# Altium schematic sheet 11-IMU.SchDoc
size A4
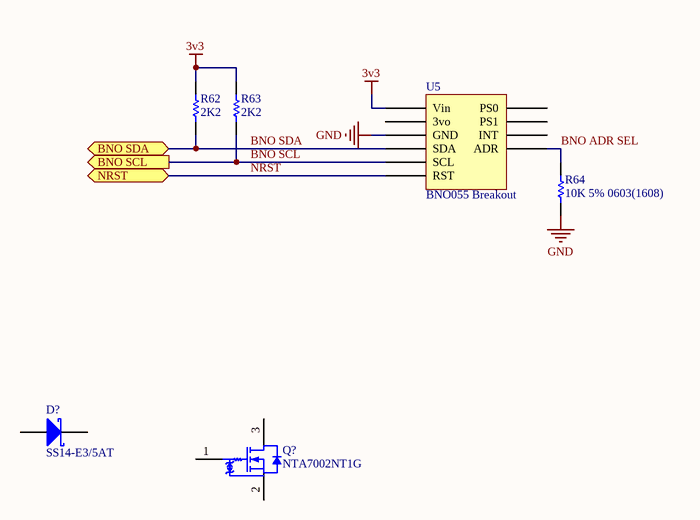
[diagram p0: 11-IMU.SchDoc]

## Parts
D?  SS14-E3/5AT  [VISH-DO-214AC-2_V]
Q?  NTA7002NT1G  [ONSC-SC-75-3-463-01_V]
R62  2K2  [RESC0603(1608)_N]
R63  2K2  [RESC0603(1608)_N]
R64  10K 5% 0603(1608)  [RESC0603(1608)_N]
U5  BNO055 Breakout  [BNO055]

## Ports
BNO SCL (out), BNO SDA (bidir), NRST (bidir)

## Nets
3v3: R62.2 R63.2 U5.1(Vin)
GND: R64.1 U5.3(GND)
BNO ADR SEL: R64.2 U5.10(ADR)
BNO SCL: R63.1 U5.5(SCL) ; port BNO SCL
BNO SDA: R62.1 U5.4(SDA) ; port BNO SDA
NRST: U5.6(RST) ; port NRST

Not connected (* = marked no-connect by the designer): D? 1(A) 2(K); Q? 1(G) 2(S) 3(D); U5 2(3vo) 7(PS0) 8(PS1) 9(INT)

## Library data of the parts
D? = CMP-0549-00004-1: Schottky Barrier Rectifier, 40 V Maximum DC Blocking Voltage, -65 to 125 degC, 2-Pin SMA Case, RoHS; Manufacturer: Vishay Semiconductor; IFSM: 40 A; IF(AV): 1 A Max.; VRRM: 40 V Max.; VRMS: 28 V Max.; PackageReference: DO-214AC-2; RoHS: TRUE; DatasheetVersion: 12/17/2012; ComponentLink1Description: Manufacturer URL; ComponentLink2URL: http://www.vishay.com/docs/88746/ss12.pdf; PartNumber: SS14-E3/5AT; PackageVersion: Dec-12; Operating Temperature: -65 to 125 degC; ComponentLink3URL: http://www.vishay.com/docs/88746/ss12.pdf; PackageDescription: 2-Pin SMD, Body 4.245 x 2.665 mm, Height 2.29 mm; ComponentLink1URL: http://www.vishay.com/; ComponentLink3Description: Package Specification; ComponentLink2Description: Datasheet; Mounting Technology: Surface Mount; VDC: 40 V Max.
Q? = CMP-1058-00646-1: Small Signal MOSFET, 30 V, 154 mA, Single, N-Channel, Gate ESD Protection, 3-Pin SC75, Pb-Free, Tape and Reel; Manufacturer: On Semiconductor; Coss Typ (pF): 10; Crss Typ (pF): 3.5; Ciss Typ (pF): 11.5; V(BR)DSS Min (V): 30; Channel Polarity: N Channel; VGS(th) Max (V): 1.5; PD Max (W): 0.3; ID Max (A): 0.154; PackageReference: SC-75-3-463-01; ComponentLink3Description: Package Specification; PartNumber: NTA7002NT1G; PackageDescription: 3-Pin Small Outline Transistor, Body 1.6 x 0.8 mm, Pitch 0.5 mm; ComponentLink3URL: http://www.onsemi.com/pub_link/Collateral/463-01.PDF; Package Type: SC-75-3; Packing: Tape and Reel; Configuration: Single; PackageVersion: Rev. F, 07/2005; ComponentLink2Description: Datasheet; ComponentLink1URL: http://www.onsemi.com/; ComponentLink1Description: Manufacturer URL; DatasheetVersion: Rev. 5; VGS Max (V): 10; Mounting Technology: Surface Mount; RoHS: Pb-Free; ComponentLink2URL: http://www.onsemi.cn/pub_link/Collateral/NTA7002N-D.PDF
R62 R63 = CMP-1012-00082-1: 2K2 0.1W 5% 0603 (1608 Metric)  SMD; Case-Metric: 1608; Value: 2200.00 Ohm; Case-EIA: 0603; Power: 0.1 W; Tolerance: 5 %; Technology: SMT
R64 = CMP-1012-00098-1: 10K 0.1W 5% 0603 (1608 Metric)  SMD; Case-EIA: 0603; Value: 10000.00 Ohm; Case-Metric: 1608; Technology: SMT; Tolerance: 5 %; Power: 0.1 W